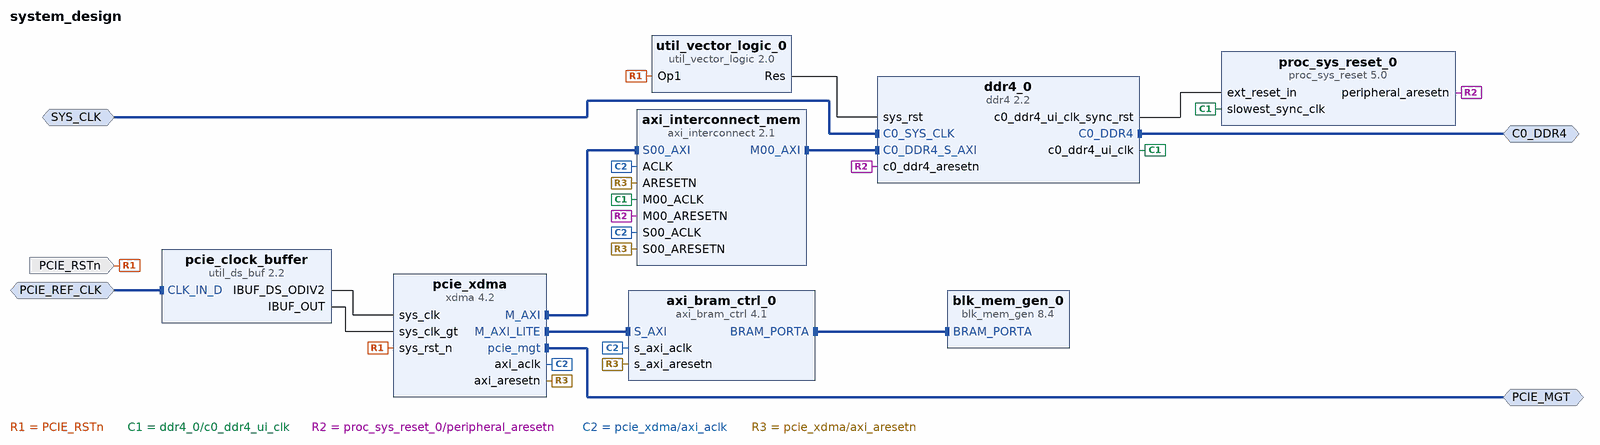
[diagram p0: block diagram of the top level]
# Vivado block design system_design, xcku060-ffva1156-2-i, Vivado 2025.2.1
create_bd_design system_design

create_bd_intf_port -mode Master -vlnv xilinx.com:interface:ddr4_rtl:1.0 C0_DDR4
create_bd_intf_port -mode Slave -vlnv xilinx.com:interface:diff_clock_rtl:1.0 SYS_CLK
set_property -dict {CONFIG.FREQ_HZ 200000000} [get_bd_intf_ports SYS_CLK]
create_bd_intf_port -mode Slave -vlnv xilinx.com:interface:diff_clock_rtl:1.0 PCIE_REF_CLK
create_bd_intf_port -mode Master -vlnv xilinx.com:interface:pcie_7x_mgt_rtl:1.0 PCIE_MGT
create_bd_port -dir I -type rst PCIE_RSTn

create_bd_cell -type ip -vlnv xilinx.com:ip:ddr4:2.2 ddr4_0
set_property -dict [list \
  CONFIG.C0.BANK_GROUP_WIDTH 1 \
  CONFIG.C0.DDR4_AxiAddressWidth 32 \
  CONFIG.C0.DDR4_AxiDataWidth 512 \
  CONFIG.C0.DDR4_AxiIDWidth 1 \
  CONFIG.C0.DDR4_DataWidth 64 \
  CONFIG.C0.DDR4_InputClockPeriod 4998 \
  CONFIG.C0.DDR4_MemoryPart MT40A512M16LY-075 \
] [get_bd_cells ddr4_0]
create_bd_cell -type ip -vlnv xilinx.com:ip:util_vector_logic:2.0 util_vector_logic_0
set_property -dict {CONFIG.C_OPERATION not CONFIG.C_SIZE 1} [get_bd_cells util_vector_logic_0]
create_bd_cell -type ip -vlnv xilinx.com:ip:xdma:4.2 pcie_xdma
set_property -dict [list \
  CONFIG.PF0_DEVICE_ID_mqdma 9034 \
  CONFIG.PF0_SRIOV_VF_DEVICE_ID A034 \
  CONFIG.PF2_DEVICE_ID_mqdma 9234 \
  CONFIG.PF3_DEVICE_ID_mqdma 9334 \
  CONFIG.axi_data_width 128_bit \
  CONFIG.axilite_master_en true \
  CONFIG.axist_bypass_en false \
  CONFIG.axisten_freq 250 \
  CONFIG.cfg_mgmt_if false \
  CONFIG.coreclk_freq 500 \
  CONFIG.pciebar2axibar_axil_master 0x00000000 \
  CONFIG.pf0_base_class_menu Memory_controller \
  CONFIG.pf0_class_code_base 05 \
  CONFIG.pf0_class_code_interface 00 \
  CONFIG.pf0_class_code_sub 80 \
  CONFIG.pf0_device_id 7022 \
  CONFIG.pf0_interrupt_pin NONE \
  CONFIG.pf0_msi_cap_multimsgcap 4_vectors \
  CONFIG.pf0_sub_class_interface_menu Other_memory_controller \
  CONFIG.pf0_subsystem_id 2D3D \
  CONFIG.pf0_subsystem_vendor_id C10E \
  CONFIG.pl_link_cap_max_link_speed 8.0_GT/s \
  CONFIG.pl_link_cap_max_link_width X4 \
  CONFIG.plltype QPLL1 \
  CONFIG.xdma_rnum_chnl 4 \
  CONFIG.xdma_wnum_chnl 4 \
] [get_bd_cells pcie_xdma]
create_bd_cell -type ip -vlnv xilinx.com:ip:util_ds_buf:2.2 pcie_clock_buffer
set_property -dict {CONFIG.C_BUF_TYPE IBUFDSGTE} [get_bd_cells pcie_clock_buffer]
create_bd_cell -type ip -vlnv xilinx.com:ip:proc_sys_reset:5.0 proc_sys_reset_0
create_bd_cell -type ip -vlnv xilinx.com:ip:axi_interconnect:2.1 axi_interconnect_mem
set_property -dict {CONFIG.NUM_MI 1} [get_bd_cells axi_interconnect_mem]
create_bd_cell -type ip -vlnv xilinx.com:ip:blk_mem_gen:8.4 blk_mem_gen_0
create_bd_cell -type ip -vlnv xilinx.com:ip:axi_bram_ctrl:4.1 axi_bram_ctrl_0
set_property -dict {CONFIG.PROTOCOL AXI4LITE CONFIG.READ_LATENCY 2 CONFIG.SINGLE_PORT_BRAM 1} [get_bd_cells axi_bram_ctrl_0]

# ---- connections ----

connect_bd_intf_net -intf_net C0_SYS_CLK_0_1 [get_bd_intf_ports SYS_CLK] [get_bd_intf_pins ddr4_0/C0_SYS_CLK]
connect_bd_intf_net -intf_net CLK_IN_D_0_1 [get_bd_intf_ports PCIE_REF_CLK] [get_bd_intf_pins pcie_clock_buffer/CLK_IN_D]
connect_bd_intf_net [get_bd_intf_pins blk_mem_gen_0/BRAM_PORTA] [get_bd_intf_pins axi_bram_ctrl_0/BRAM_PORTA]
connect_bd_intf_net -intf_net axi_interconnect_0_M00_AXI [get_bd_intf_pins axi_interconnect_mem/M00_AXI] [get_bd_intf_pins ddr4_0/C0_DDR4_S_AXI]
connect_bd_intf_net [get_bd_intf_ports C0_DDR4] [get_bd_intf_pins ddr4_0/C0_DDR4]
connect_bd_intf_net -intf_net xdma_0_M_AXI [get_bd_intf_pins pcie_xdma/M_AXI] [get_bd_intf_pins axi_interconnect_mem/S00_AXI]
connect_bd_intf_net -intf_net xdma_0_M_AXI_LITE [get_bd_intf_pins pcie_xdma/M_AXI_LITE] [get_bd_intf_pins axi_bram_ctrl_0/S_AXI]
connect_bd_intf_net -intf_net xdma_0_pcie_mgt [get_bd_intf_ports PCIE_MGT] [get_bd_intf_pins pcie_xdma/pcie_mgt]
connect_bd_net [get_bd_ports PCIE_RSTn] [get_bd_pins util_vector_logic_0/Op1] [get_bd_pins pcie_xdma/sys_rst_n]
connect_bd_net [get_bd_pins ddr4_0/c0_ddr4_ui_clk] [get_bd_pins proc_sys_reset_0/slowest_sync_clk] [get_bd_pins axi_interconnect_mem/M00_ACLK]
connect_bd_net [get_bd_pins ddr4_0/c0_ddr4_ui_clk_sync_rst] [get_bd_pins proc_sys_reset_0/ext_reset_in]
connect_bd_net [get_bd_pins proc_sys_reset_0/peripheral_aresetn] [get_bd_pins axi_interconnect_mem/M00_ARESETN] [get_bd_pins ddr4_0/c0_ddr4_aresetn]
connect_bd_net -net util_ds_buf_0_IBUF_DS_ODIV2 [get_bd_pins pcie_clock_buffer/IBUF_DS_ODIV2] [get_bd_pins pcie_xdma/sys_clk]
connect_bd_net -net util_ds_buf_0_IBUF_OUT [get_bd_pins pcie_clock_buffer/IBUF_OUT] [get_bd_pins pcie_xdma/sys_clk_gt]
connect_bd_net [get_bd_pins util_vector_logic_0/Res] [get_bd_pins ddr4_0/sys_rst]
connect_bd_net -net xdma_0_axi_aclk [get_bd_pins pcie_xdma/axi_aclk] \
  [get_bd_pins axi_interconnect_mem/ACLK] [get_bd_pins axi_interconnect_mem/S00_ACLK] \
  [get_bd_pins axi_bram_ctrl_0/s_axi_aclk]
connect_bd_net -net xdma_0_axi_aresetn [get_bd_pins pcie_xdma/axi_aresetn] \
  [get_bd_pins axi_interconnect_mem/ARESETN] [get_bd_pins axi_interconnect_mem/S00_ARESETN] \
  [get_bd_pins axi_bram_ctrl_0/s_axi_aresetn]

# ---- address map ----
assign_bd_address -offset 0x0000000100000000 -range 4G -target_address_space [get_bd_addr_spaces pcie_xdma/M_AXI] [get_bd_addr_segs ddr4_0/C0_DDR4_MEMORY_MAP/C0_DDR4_ADDRESS_BLOCK]
assign_bd_address -offset 0x00000000 -range 8K -target_address_space [get_bd_addr_spaces pcie_xdma/M_AXI_LITE] [get_bd_addr_segs axi_bram_ctrl_0/S_AXI/Mem0]

validate_bd_design
save_bd_design
